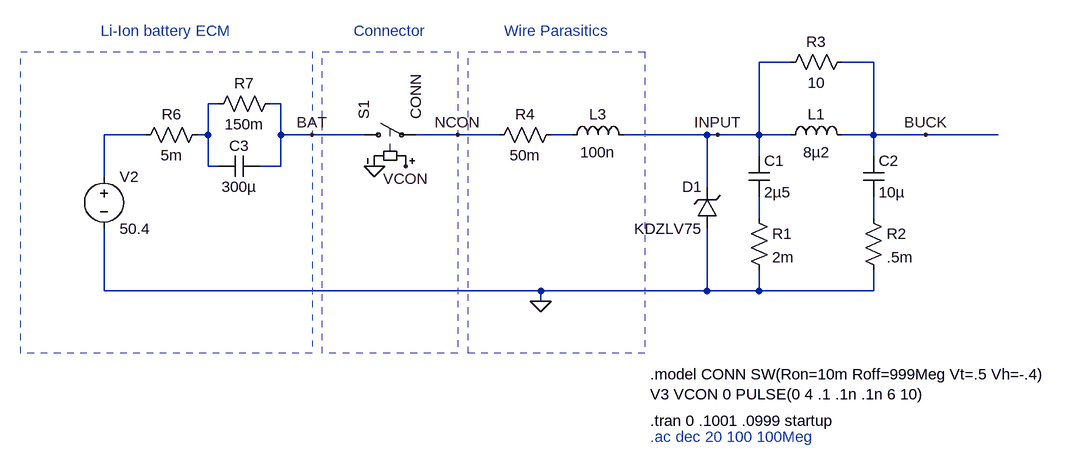
[diagram p0: schematic input_filter.asc]
input_filter.asc, the LTspice schematic file:
Version 4
SHEET 1 1592 680
WIRE 880 64 832 64
WIRE 1008 64 960 64
WIRE 0 128 -16 128
WIRE 96 128 80 128
WIRE -112 176 -176 176
WIRE -16 176 -16 128
WIRE -16 176 -32 176
WIRE 96 176 96 128
WIRE 144 176 96 176
WIRE 224 176 144 176
WIRE 368 176 304 176
WIRE 432 176 368 176
WIRE 544 176 512 176
WIRE 752 176 624 176
WIRE 768 176 752 176
WIRE 832 176 832 64
WIRE 832 176 768 176
WIRE 880 176 832 176
WIRE 1008 176 1008 64
WIRE 1008 176 960 176
WIRE 1088 176 1008 176
WIRE 1200 176 1088 176
WIRE 832 208 832 176
WIRE 1008 208 1008 176
WIRE -16 224 -16 176
WIRE 0 224 -16 224
WIRE 96 224 96 176
WIRE 96 224 64 224
WIRE -176 240 -176 176
WIRE 752 256 752 176
WIRE 832 304 832 272
WIRE 1008 304 1008 272
WIRE -176 416 -176 320
WIRE 496 416 -176 416
WIRE 752 416 752 320
WIRE 752 416 496 416
WIRE 832 416 832 384
WIRE 832 416 752 416
WIRE 1008 416 1008 384
WIRE 1008 416 832 416
WIRE 496 432 496 416
FLAG 496 432 0
FLAG 240 224 0
FLAG 288 224 VCON
FLAG 768 176 INPUT
FLAG 1088 176 BUCK
FLAG 368 176 NCON
FLAG 144 176 BAT
SYMBOL cap 992 208 R0
SYMATTR InstName C2
SYMATTR Value 10µ
SYMBOL res 992 288 R0
SYMATTR InstName R2
SYMATTR Value .5m
SYMBOL sw 208 176 R270
SYMATTR InstName S1
SYMATTR Value CONN
SYMBOL res 528 160 R90
WINDOW 0 0 56 VBottom 2
WINDOW 3 32 56 VTop 2
SYMATTR InstName R4
SYMATTR Value 50m
SYMBOL ind 528 192 R270
WINDOW 0 32 56 VTop 2
WINDOW 3 5 56 VBottom 2
SYMATTR InstName L3
SYMATTR Value 100n
SYMBOL voltage -176 224 R0
WINDOW 123 0 0 Left 0
WINDOW 39 0 0 Left 0
SYMATTR InstName V2
SYMATTR Value 50.4
SYMBOL res -16 160 R90
WINDOW 0 0 56 VBottom 2
WINDOW 3 32 56 VTop 2
SYMATTR InstName R6
SYMATTR Value 5m
SYMBOL cap 64 208 R90
WINDOW 0 0 32 VBottom 2
WINDOW 3 32 32 VTop 2
SYMATTR InstName C3
SYMATTR Value 300µ
SYMBOL res 96 112 R90
WINDOW 0 0 56 VBottom 2
WINDOW 3 32 56 VTop 2
SYMATTR InstName R7
SYMATTR Value 150m
SYMBOL ind 864 192 R270
WINDOW 0 32 56 VTop 2
WINDOW 3 5 56 VBottom 2
SYMATTR InstName L1
SYMATTR Value 8µ2
SYMBOL cap 816 208 R0
SYMATTR InstName C1
SYMATTR Value 2µ5
SYMBOL res 816 288 R0
SYMATTR InstName R1
SYMATTR Value 2m
SYMBOL res 976 48 R90
WINDOW 0 0 56 VBottom 2
WINDOW 3 32 56 VTop 2
SYMATTR InstName R3
SYMATTR Value 10
SYMBOL zener 768 320 R180
WINDOW 0 24 64 Left 2
WINDOW 3 24 0 Left 2
SYMATTR InstName D1
SYMATTR Value KDZLV75
TEXT 664 640 Left 2 ;.ac dec 20 100 100Meg
TEXT 664 544 Left 2 !.model CONN SW(Ron=10m Roff=999Meg Vt=.5 Vh=-.4)\nV3 VCON 0 PULSE(0 4 .1 .1n .1n 6 10)
TEXT 664 616 Left 2 !.tran 0 .1001 .0999 startup
TEXT -80 16 Center 2 ;Li-Ion battery ECM
TEXT 264 16 Center 2 ;Connector
TEXT 520 16 Center 2 ;Wire Parasitics
RECTANGLE Normal 144 512 -304 48 1
RECTANGLE Normal 368 512 160 48 1
RECTANGLE Normal 656 512 384 48 1

The netlist it stands for:
* input_filter.asc
C2 BUCK N005 10µ
R2 N005 0 .5m
S1 BAT NCON VCON 0 CONN
R4 N003 NCON 50m
L3 N003 INPUT 100n
V2 N002 0 50.4
R6 N001 N002 5m
C3 BAT N001 300µ
R7 BAT N001 150m
L1 INPUT BUCK 8µ2
C1 INPUT N004 2µ5
R1 N004 0 2m
R3 BUCK INPUT 10
D1 0 INPUT KDZLV75
.model D D
.lib standard.dio
* .ac dec 20 100 100Meg
.model CONN SW(Ron=10m Roff=999Meg Vt=.5 Vh=-.4)
V3 VCON 0 PULSE(0 4 .1 .1n .1n 6 10)
.tran 0 .1001 .0999 startup
* Li-Ion battery ECM
* Connector
* Wire Parasitics
.backanno
.end